# EAGLE design HASP_PARASITE (EAGLE 9.3.1)
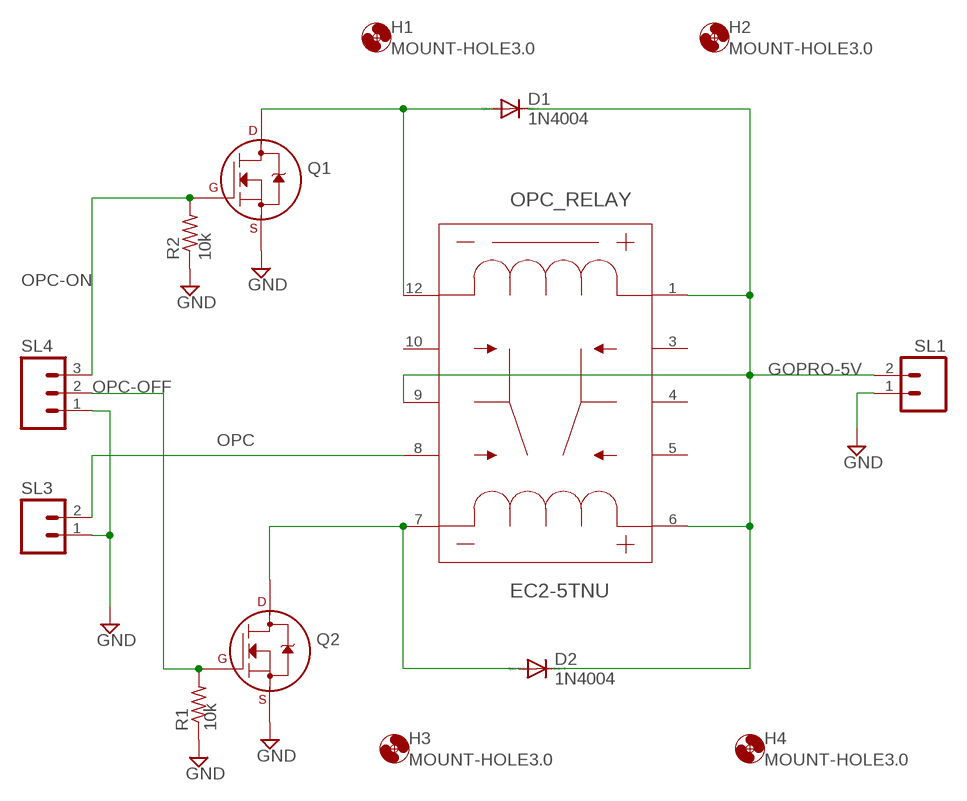
[diagram p0: schematic, sheet 1]

## Parts
D1  1N4004  [DO41-10]
D2  1N4004  [DO41-10]
H1  MOUNT-HOLE3.0  [3,0]
H2  MOUNT-HOLE3.0  [3,0]
H3  MOUNT-HOLE3.0  [3,0]
H4  MOUNT-HOLE3.0  [3,0]
OPC_RELAY  EC2-5TNU  [EC2TNU]
Q1  2N7000_TO92  [TO-92]
Q2  2N7000_TO92  [TO-92]
R1  R-US_0207/7  [0207/7]
R2  R-US_0207/7  [0207/7]
SL1  M02  [02P]
SL3  M02  [02P]
SL4  M03  [03P]

## Nets
GND: Q1.1(S) Q2.1(S) R1.1 R2.1 SL1.1 SL3.1 SL4.1
GOPRO-5V: D1.C D2.C OPC_RELAY.1 OPC_RELAY.6 OPC_RELAY.9 SL1.2
N$1: D1.A OPC_RELAY.12 Q1.3(D)
N$3: D2.A OPC_RELAY.7 Q2.3(D)
OPC: OPC_RELAY.8 SL3.2
OPC-OFF: Q2.2(G) R1.2 SL4.2
OPC-ON: Q1.2(G) R2.2 SL4.3
Unconnected: OPC_RELAY.3 OPC_RELAY.4 OPC_RELAY.5 OPC_RELAY.10

## Notes on the sheet
- 10k
- 10k

## Library data of the parts
D1 D2 = diode:1N4004: DIODE general purpose rectifier, 1 A
H1-H4 = holes:MOUNT-HOLE: MOUNTING HOLE with drill center marker
OPC_RELAY = EC2-5TNU:EC2-5TNU; MANUFACTURER_PART_NUMBER: EC25TNU; VENDOR: KEMET
Q1 Q2 = transistors:2N700*: 2N7000, 2N7002, NDS7002A N-channel enhancement mode MOSFET
R1 R2 = rcl:R-US_: RESISTOR, American symbol; SPICEPREFIX: R
SL1 SL3 = con-amp-quick:M02: AMP QUICK CONNECTOR; OC_FARNELL: unknown; OC_NEWARK: unknown
SL4 = con-amp-quick:M03: AMP QUICK CONNECTOR; OC_FARNELL: unknown; OC_NEWARK: unknown

## Board
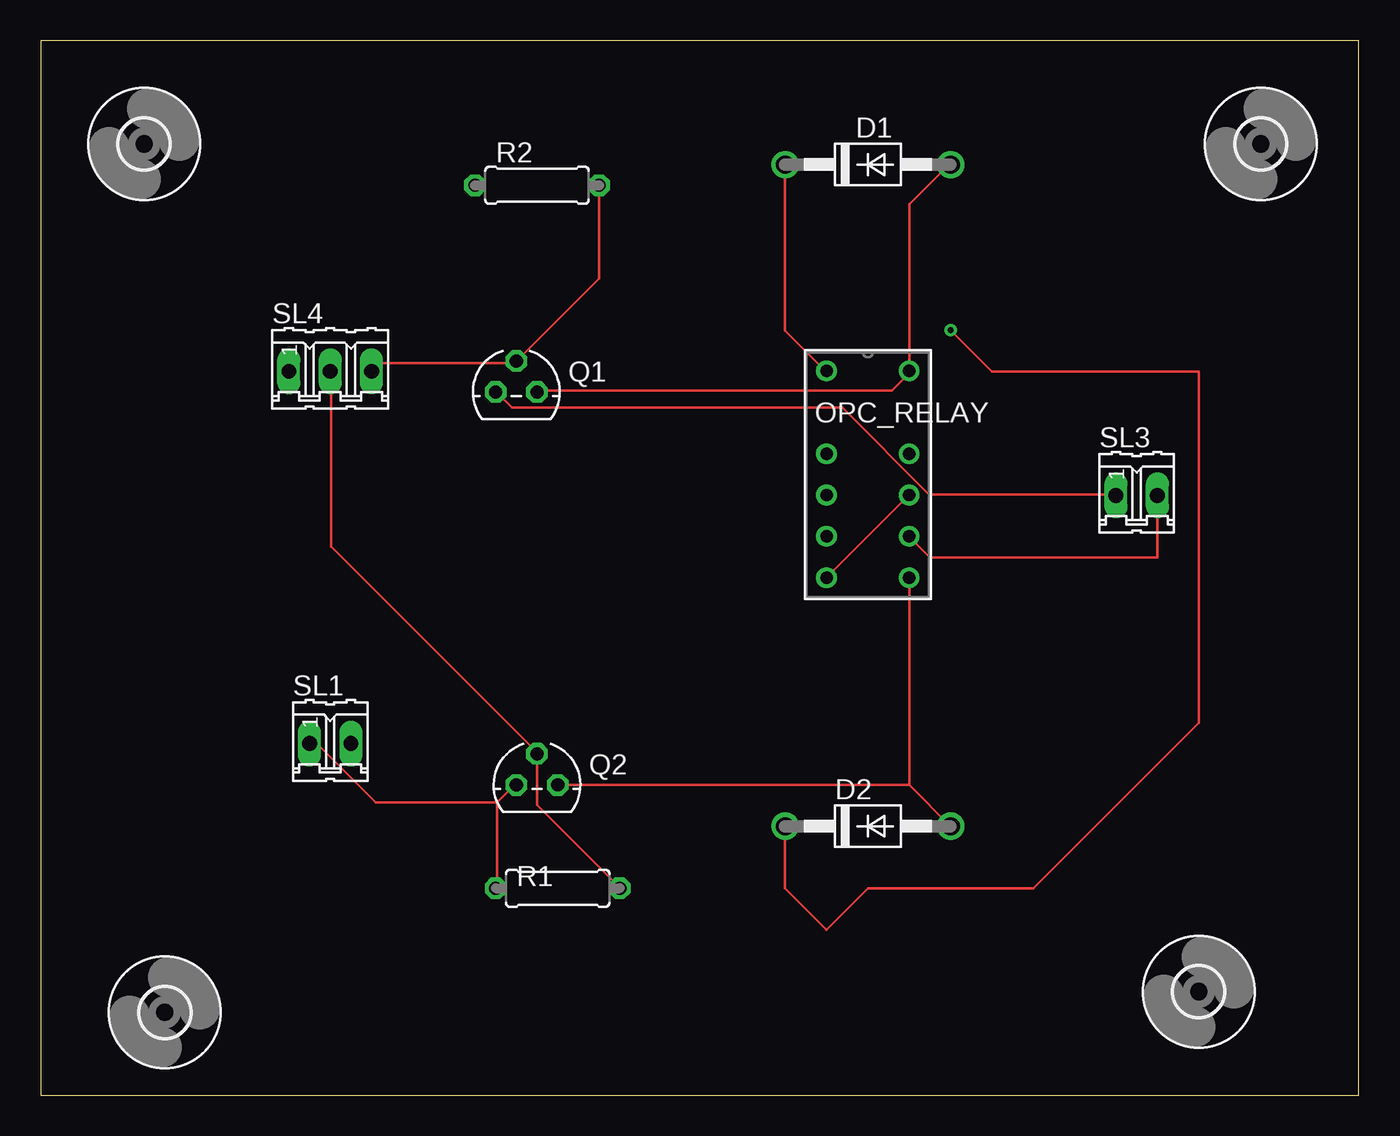
[diagram p1: board, top side]
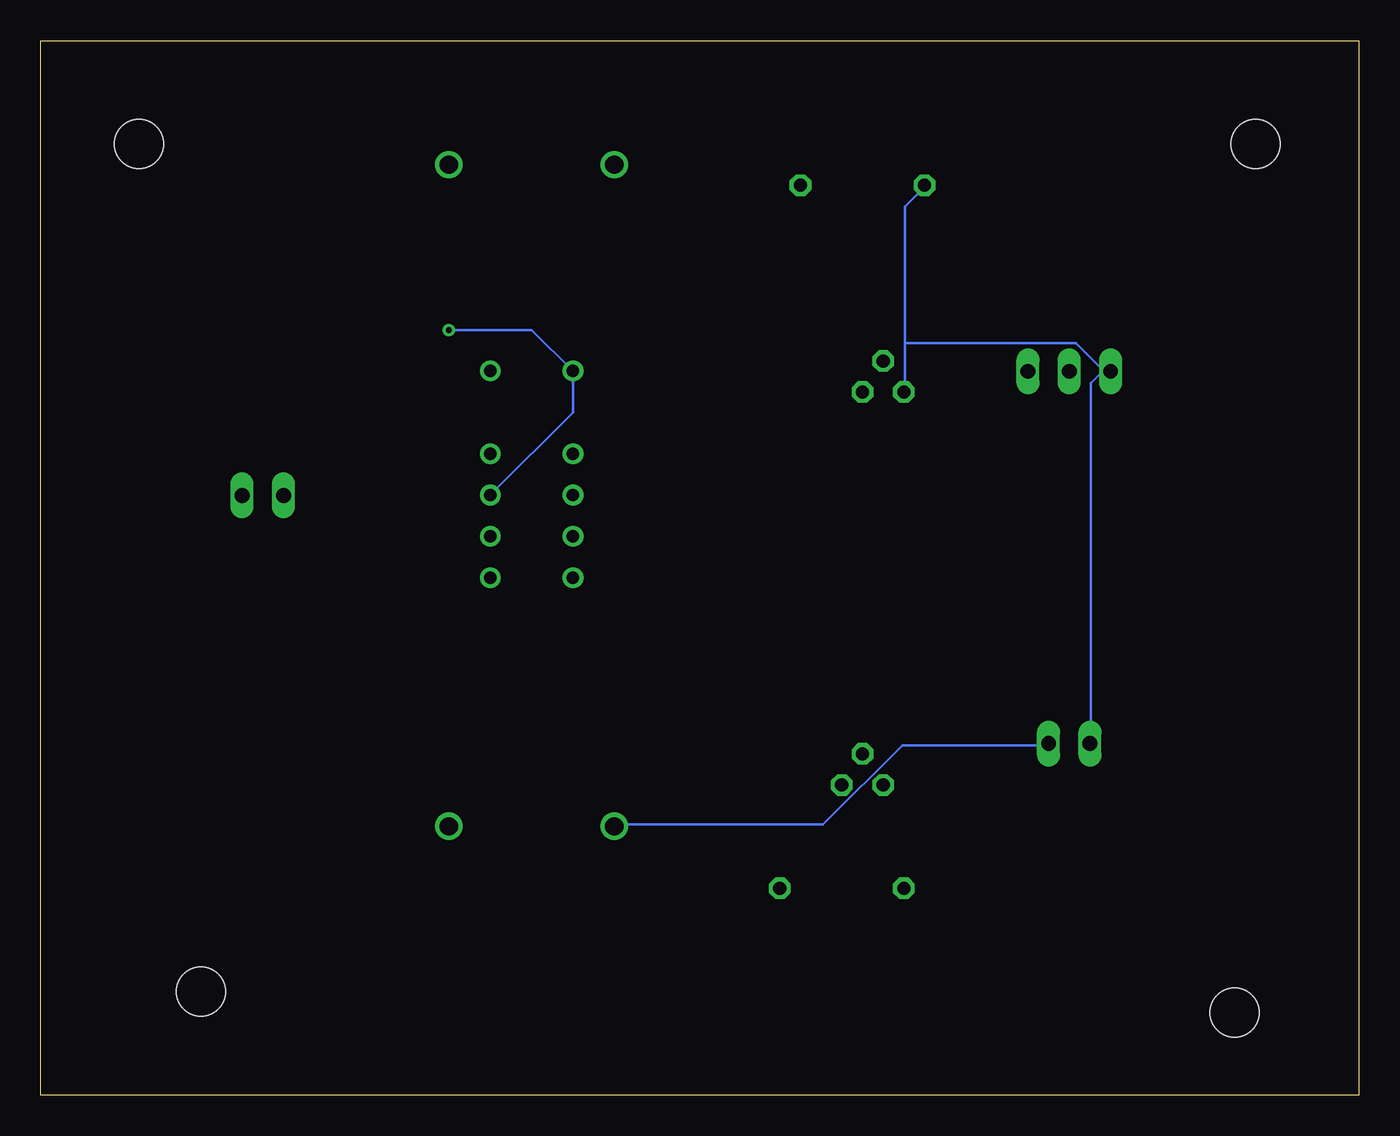
[diagram p2: board, bottom side, seen from below]

Size 80.95 x 64.76 mm. Coordinates in mm from the lower left corner, seen from the top.
Outline: 0,0 80.95,0 80.95,64.76 0,64.76 0,0
Copper layers (1*16): Top 0.035mm / dielectric 1.5mm / Bottom 0.035mm
Design rules "default": minimum track width 6mil, minimum drill 0.35mm, track to track 6mil, track to pad 6mil, pad to pad 6mil, via to via 6mil, smd to smd 6mil, copper to edge 40mil, drill to drill 6mil, minimum pad ring 10mil, minimum via ring 8mil, stop-mask expansion 4mil, vias tented up to drill 0mil, thermal gap 10mil

### Footprints (pad centres in the part's own frame; a part is rotated, then mirrored left to right if it is on the bottom)
DO41-10 = drill 1.118: A 5.08,0; C -5.08,0
3,0 = hole 3: 0,0
EC2TNU = drill 0.762 pad 1.27: 1 -2.54,6.375; 3 -2.54,1.295; 4 -2.54,-1.245; 5 -2.54,-3.785; 6 -2.54,-6.325; 7 2.54,-6.325; 8 2.54,-3.785; 9 2.54,-1.245; 10 2.54,1.295; 12 2.54,6.375
TO-92 = drill 0.813 octagon: 1 -1.27,0; 2 0,1.905; 3 1.27,0
0207/7 = drill 0.813 octagon: 1 -3.81,0; 2 3.81,0
02P = drill 0.914 long: 1 -1.27,0; 2 1.27,0
03P = drill 0.914 long: 1 -2.54,0; 2 0,0; 3 2.54,0

### Placement (x,y rotation side)
D1  50.8,57.15 0 top
D2  50.8,16.51 0 top
H1  7.62,5.08 0 top
H2  6.35,58.42 0 top
H3  74.93,58.42 0 top
H4  71.12,6.35 0 top
OPC_RELAY  50.8,38.1 0 top
Q1  29.21,43.18 0 top
Q2  30.48,19.05 0 top
R1  31.75,12.7 0 top
R2  30.48,55.88 0 top
SL1  17.78,21.59 0 top
SL3  67.31,36.83 0 top
SL4  17.78,44.45 0 top

### Tracks (layer width: path | path; a pad name or v marks a point on that pad's centre or on a via)
GND
  Top 0.152: 28.04,17.98 28.04,12.8 R1.1 | 28.04,17.98 29.11,19.05 Q2.1 | 28.04,17.98 20.57,17.98 17.07,21.49 16.61,21.49 SL1.1 | SL3.1 65.99,36.88 54.56,36.88 49.23,42.22 28.96,42.22 28.04,43.13 Q1.1
  Bottom 0.152: 27.89,46.18 27.89,54.56 26.67,55.78 R2.1 | 27.89,46.18 27.89,43.28 Q1.1 | 15.7,44.5 15.24,44.5 SL4.1 15.7,44.5 | 15.7,44.5 17.37,46.18 27.89,46.18 | 15.7,44.5 16.46,43.74 16.46,21.64 SL1.1
GOPRO-5V  (via drill 0.35)
  Top 0.152: OPC_RELAY.6 48.31,31.85 53.34,36.88 OPC_RELAY.9 | D1.C 45.72,46.94 48.16,44.5 OPC_RELAY.1 | D2.C 45.72,12.7 48.26,10.16 50.8,12.7 60.96,12.7 71.12,22.86 71.12,44.45 58.42,44.45 v55.88,46.99
  Bottom 0.152: SL1.2 19.05,21.49 28.04,21.49 32.92,16.61 45.72,16.61 D2.C | 48.31,44.35 48.27,44.45 | 48.27,44.45 OPC_RELAY.1 48.26,41.94 OPC_RELAY.9 53.34,36.88 | 48.16,31.7 OPC_RELAY.6 | v55.88,46.99 50.8,46.99 50.8,46.98 48.27,44.45
N$1
  Top 0.152: D1.A 55.78,57.15 53.34,54.71 OPC_RELAY.12 53.34,44.35 52.27,43.28 30.48,43.28 Q1.3
N$3
  Top 0.152: 53.34,19.05 OPC_RELAY.7 | D2.A 53.34,19.05 | 53.34,19.05 Q2.3
OPC
  Top 0.152: 53.34,34.44 OPC_RELAY.8 53.34,34.29 54.61,33.02 68.58,33.02 SL3.2 68.58,36.73
OPC-OFF
  Top 0.152: R1.2 35.51,12.8 30.48,17.83 Q2.2 30.48,21.03 17.83,33.68 17.83,44.35 SL4.2
OPC-ON
  Top 0.152: SL4.3 20.42,44.5 20.88,44.96 29.11,44.96 Q1.2 29.26,45.11 34.29,50.14 R2.2